# EAGLE design Potentiostat (EAGLE 9.6.2)
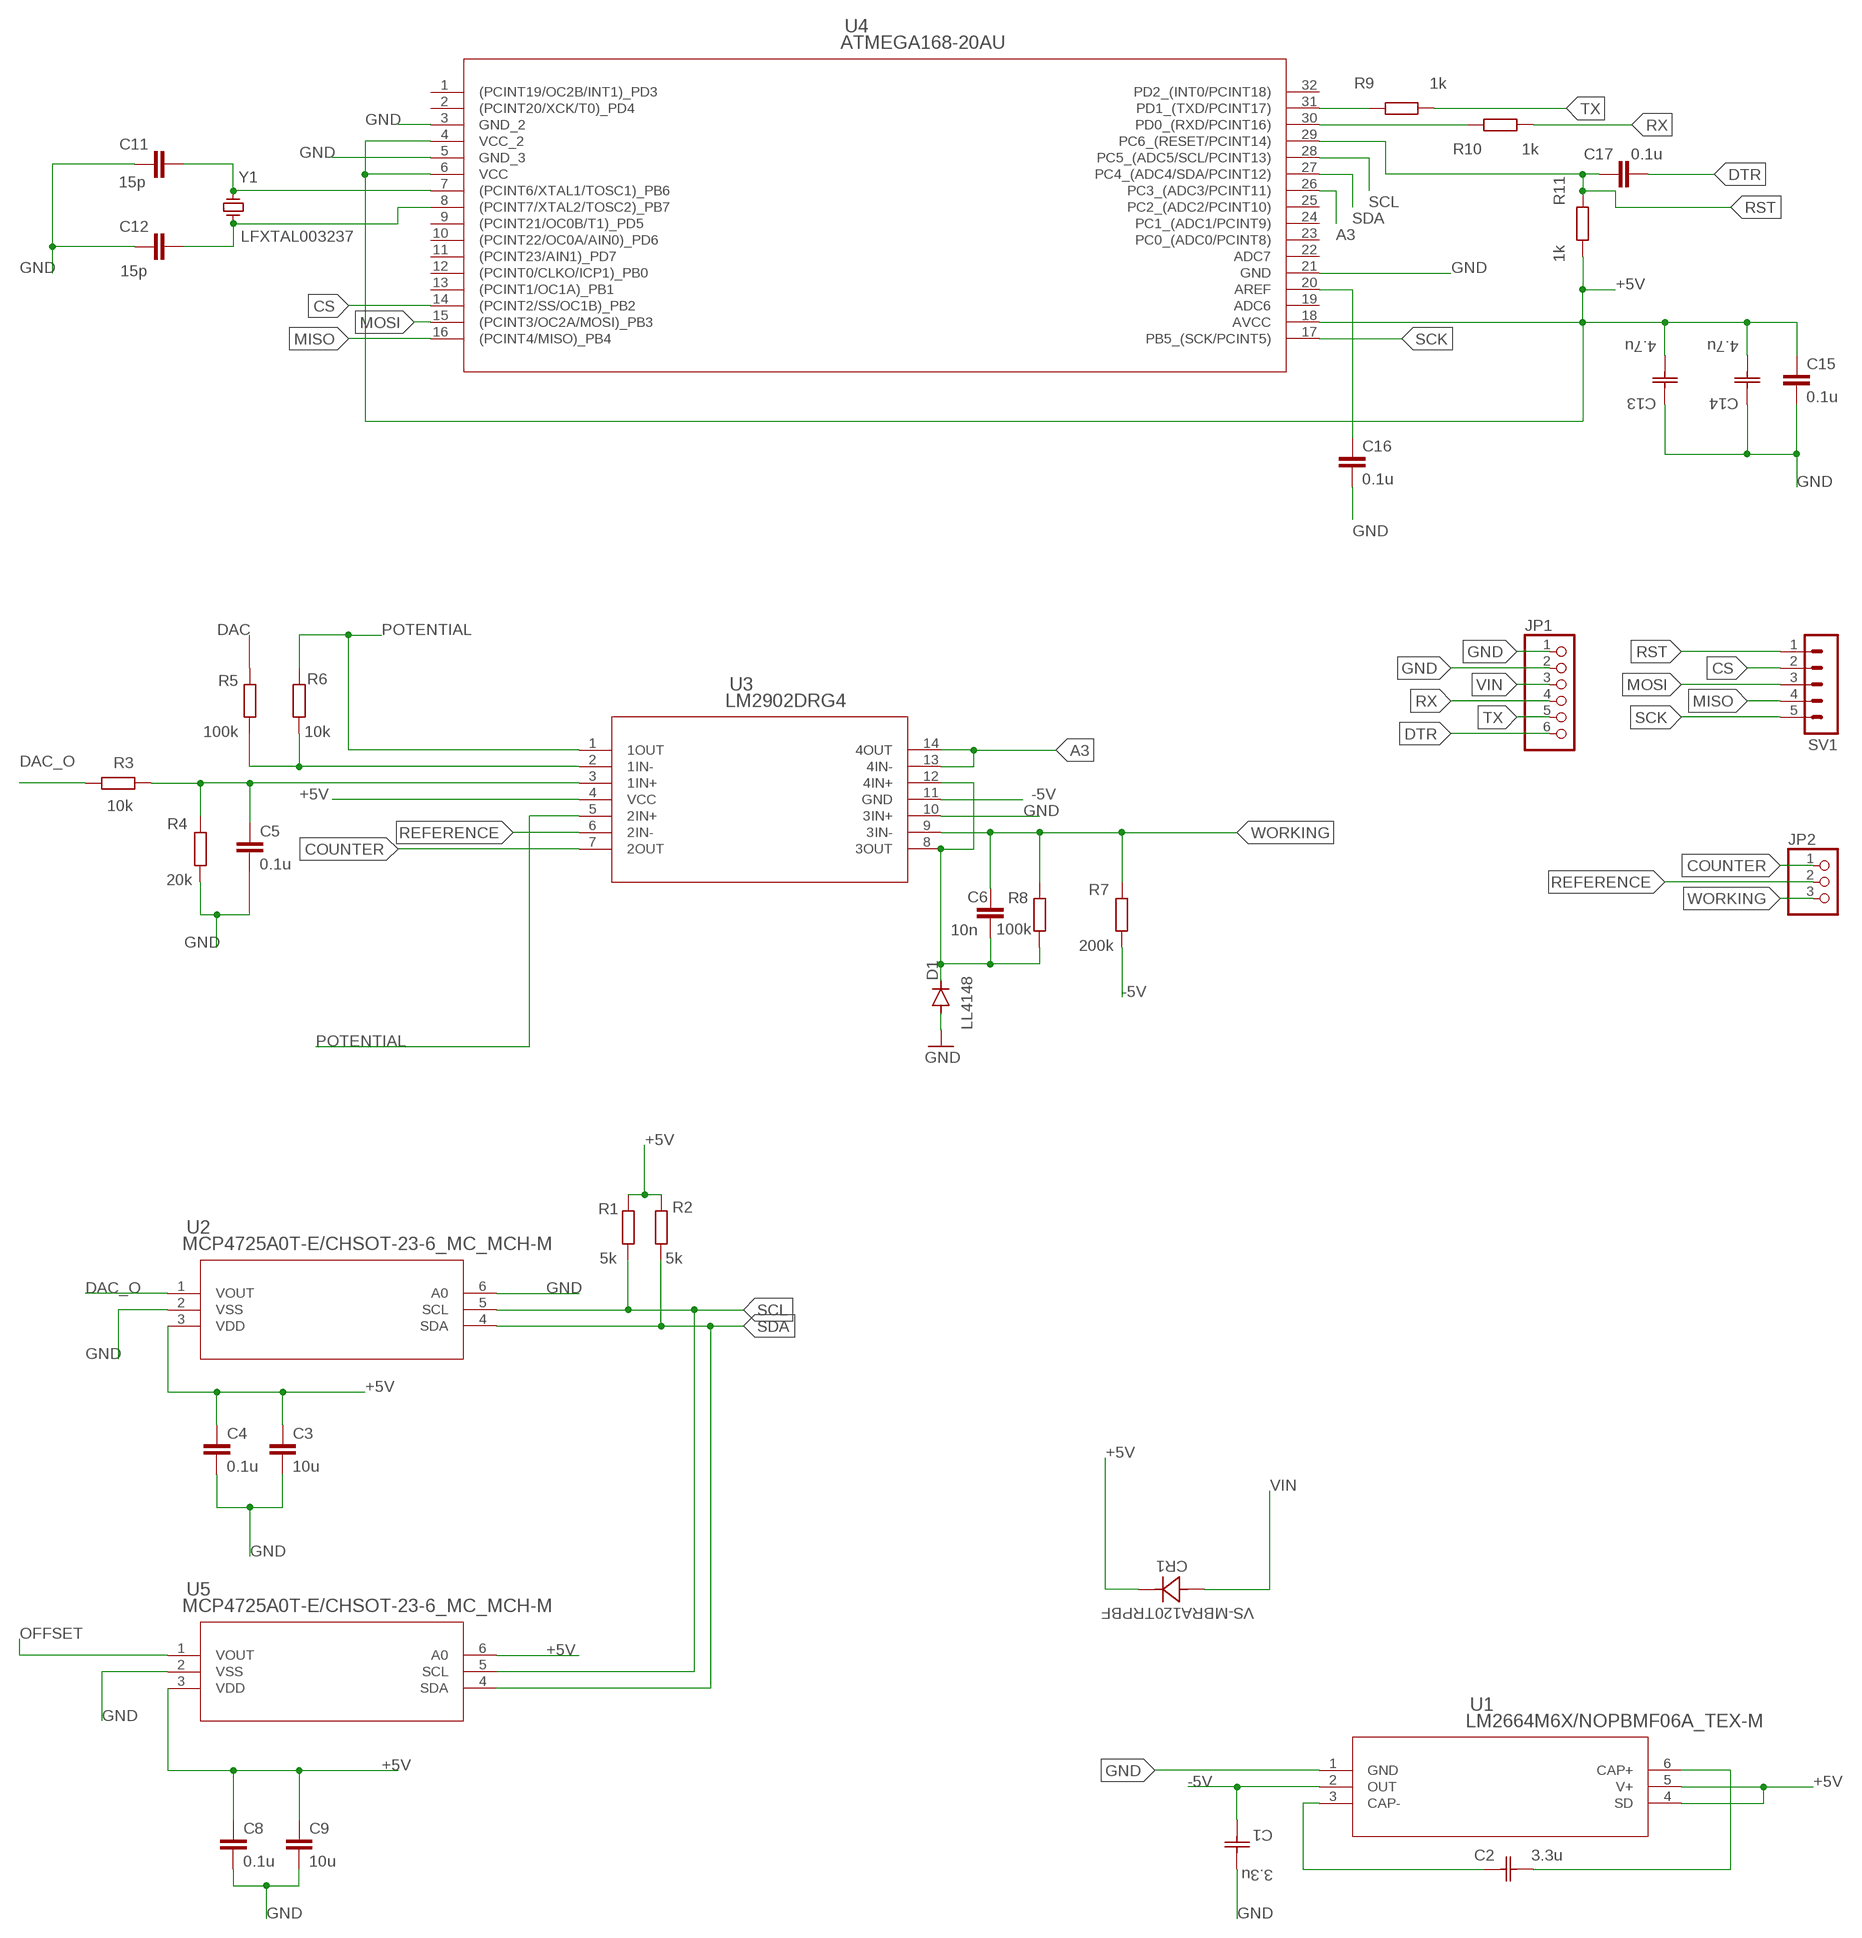
[diagram p0: schematic, sheet 1]

## Parts
C1  3.3u  293D335X9016A2TE3CAP_293D_A_VIS-M  [CAP_293D_A_VIS-M]
C2  3.3u  293D335X9016A2TE3CAP_293D_A_VIS-M  [CAP_293D_A_VIS-M]
C3  10u  C-EUC0805  [C0805]
C4  0.1u  C-EUC0805  [C0805]
C5  0.1u  C-EUC0805  [C0805]
C6  10n  C-EUC0805  [C0805]
C8  0.1u  C-EUC0805  [C0805]
C9  10u  C-EUC0805  [C0805]
C11  15p  C-EUC0805  [C0805]
C12  15p  C-EUC0805  [C0805]
C13  4.7u  293D335X9016A2TE3CAP_293D_A_VIS-M  [CAP_293D_A_VIS-M]
C14  4.7u  293D335X9016A2TE3CAP_293D_A_VIS-M  [CAP_293D_A_VIS-M]
C15  0.1u  C-EUC0805  [C0805]
C16  0.1u  C-EUC0805  [C0805]
C17  0.1u  C-EUC0805  [C0805]
CR1  VS-MBRA120TRPBF  [DIODE_SMA_VIS]
D1  LL4148  DIODE-SOD80C  [SOD80C]
JP1  PINHD-1X6CB  [1X06-CLEANBIG]
JP2  PINHD-1X3CB  [1X03-CLEANBIG]
R1  5k  R-EU_R0805  [R0805]
R2  5k  R-EU_R0805  [R0805]
R3  10k  R-EU_R0805  [R0805]
R4  20k  R-EU_R0805  [R0805]
R5  100k  R-EU_R0805  [R0805]
R6  10k  R-EU_R0805  [R0805]
R7  200k  R-EU_R0805  [R0805]
R8  100k  R-EU_R0805  [R0805]
R9  1k  R-EU_R0805  [R0805]
R10  1k  R-EU_R0805  [R0805]
R11  1k  R-EU_R0805  [R0805]
SV1  MA05-1  [MA05-1]
U1  LM2664M6X/NOPBMF06A_TEX-M  [MF06A_TEX-M]
U2  MCP4725A0T-E/CHSOT-23-6_MC_MCH-M  [SOT-23-6_MC_MCH-M]
U3  LM2902DRG4  [D14_TEX]
U4  ATMEGA168-20AU  [32A_ATM]
U5  MCP4725A0T-E/CHSOT-23-6_MC_MCH-M  [SOT-23-6_MC_MCH-M]
Y1  LFXTAL003237  [XTAL1140X490X430N]

## Nets
+5V: C3.1 C4.1 C8.1 C9.1 C13.2 C14.2 C15.1 CR1.1 R1.2 R2.2 R11.1 U1.4(SD) U1.5(V+) U2.3(VDD) U3.4(VCC) U4.4(VCC_2) U4.6(VCC) U4.18(AVCC) U5.3(VDD) U5.6(A0)
-5V: C1.2 R7.1 U1.2(OUT) U3.11(GND)
A3: U3.13(4IN-) U3.14(4OUT) U4.26(PC3_(ADC3/PCINT11))
COUNTER: JP2.1 U3.7(2OUT)
CS: SV1.2 U4.14((PCINT2/SS/OC1B)_PB2)
DAC: R5.2
DAC_O: R3.2 U2.1(VOUT)
DTR: C17.2 JP1.6
GND: C1.1 C3.2 C4.2 C5.2 C8.2 C9.2 C11.1 C12.1 C13.1 C14.1 C15.2 C16.2 D1.A JP1.1 JP1.2 R4.1 U1.1(GND) U2.2(VSS) U2.6(A0) U3.10(3IN+) U4.3(GND_2) U4.5(GND_3) U4.21(GND) U5.2(VSS)
MISO: SV1.4 U4.16((PCINT4/MISO)_PB4)
MOSI: SV1.3 U4.15((PCINT3/OC2A/MOSI)_PB3)
N$1: C6.2 D1.C R8.1 U3.8(3OUT) U3.12(4IN+)
N$2: C2.1 U1.3(CAP-)
N$3: C5.1 R3.1 R4.2 U3.3(1IN+)
N$4: R5.1 R6.1 U3.2(1IN-)
N$5: C11.2 U4.7((PCINT6/XTAL1/TOSC1)_PB6) Y1.2
N$6: C2.2 U1.6(CAP+)
N$7: C12.2 U4.8((PCINT7/XTAL2/TOSC2)_PB7) Y1.1
N$9: R9.2 U4.31(PD1_(TXD/PCINT17))
N$10: R10.2 U4.30(PD0_(RXD/PCINT16))
N$12: C16.1 U4.20(AREF)
OFFSET: U5.1(VOUT)
POTENTIAL: R6.2 U3.1(1OUT) U3.5(2IN+)
REFERENCE: JP2.2 U3.6(2IN-)
RST: C17.1 R11.2 SV1.1 U4.29(PC6_(RESET/PCINT14))
RX: JP1.4 R10.1
SCK: SV1.5 U4.17(PB5_(SCK/PCINT5))
SCL: R1.1 U2.5(SCL) U4.28(PC5_(ADC5/SCL/PCINT13)) U5.5(SCL)
SDA: R2.1 U2.4(SDA) U4.27(PC4_(ADC4/SDA/PCINT12)) U5.4(SDA)
TX: JP1.5 R9.1
VIN: CR1.2 JP1.3
WORKING: C6.1 JP2.3 R7.2 R8.2 U3.9(3IN-)
Unconnected: U4.1((PCINT19/OC2B/INT1)_PD3) U4.2((PCINT20/XCK/T0)_PD4) U4.9((PCINT21/OC0B/T1)_PD5) U4.10((PCINT22/OC0A/AIN0)_PD6) U4.11((PCINT23/AIN1)_PD7) U4.12((PCINT0/CLKO/ICP1)_PB0) U4.13((PCINT1/OC1A)_PB1) U4.19(ADC6) U4.22(ADC7) U4.23(PC0_(ADC0/PCINT8)) U4.24(PC1_(ADC1/PCINT9)) U4.25(PC2_(ADC2/PCINT10)) U4.32(PD2_(INT0/PCINT18))

## Library data of the parts
C1 C2 C13 C14 = Tantal_capacitor_293D:293D335X9016A2TE3; BUILT_BY: EMA_UL_Team; MANUFACTURER_PART_NUMBER: 293D335X9016A2TE3; SOURCELIBRARY: Vishay_2020-02-10; VENDOR: Vishay
C3-C6 C8 C9 C11 C12 C15-C17 = rcl:C-EU: CAPACITOR, European symbol; SPICEPREFIX: C
CR1 = Schottky Diode SS12L R3G:VS-MBRA120TRPBF; BUILT_BY: EMA_UL_Team; MANUFACTURER_PART_NUMBER: VS-MBRA120TRPBF; SOURCELIBRARY: Vishay_2014-06-20; VENDOR: Vishay
D1 = diode:DIODE-: DIODE
JP1 = adafruit:PINHD-1X6: PIN HEADER
JP2 = adafruit:PINHD-1X3: PIN HEADER
R1-R11 = rcl:R-EU_: RESISTOR, European symbol; SPICEPREFIX: R
SV1 = con-lstb:MA05-1: PIN HEADER; OC_FARNELL: unknown; OC_NEWARK: unknown
U1 = Lm2664m6:LM2664M6X/NOPB; BUILT_BY: EMA_UL_Team; MANUFACTURER_PART_NUMBER: LM2664M6X/NOPB; SOURCELIBRARY: National_2014-06-20; VENDOR: Texas Instruments
U2 U5 = MCP4725A0T:MCP4725A0T-E/CH; BUILT_BY: EMA_UL_Team; MANUFACTURER_PART_NUMBER: MCP4725A0T-E/CH; SOURCELIBRARY: Microchip_2011-05-13; VENDOR: Microchip
U3 = LM2902DRG4:LM2902DRG4; BUILT_BY: EMA_UL_Team; MANUFACTURER: Texas Instruments; MANUFACTURER_PART_NUMBER: LM2902DRG4; SOURCELIBRARY: TI_2014-06-19; VENDOR: Texas Instruments
U4 = ATMEGA168-20AU:ATMEGA168-20AU; COPYRIGHT: Copyright (C) 2015 Accelerated Designs. All rights reserved; MANUFACTURER_PART_NUMBER: ATMEGA168-20AU; SOURCELIBRARY: Atmel_2014-06-19; VENDOR: Atmel
Y1 = LFXTAL003237:LFXTAL003237: HC49/4HSMX Series 16.000 MHz ±30 ppm 16 pF Low Profile Surface Mount Crystal; AVAILABILITY: Unavailable; DESCRIPTION: 16MHz ±30ppm Crystal 16pF 40 Ohms HC-49/US; MF: IQD Frequency Products; MP: LFXTAL003237; PACKAGE: HC-49/US IQD Frequency Products; PRICE: None

## Net classes
0 default: width 0.203 mm, drill 0.203 mm, clearance 0.203 mm

## Board
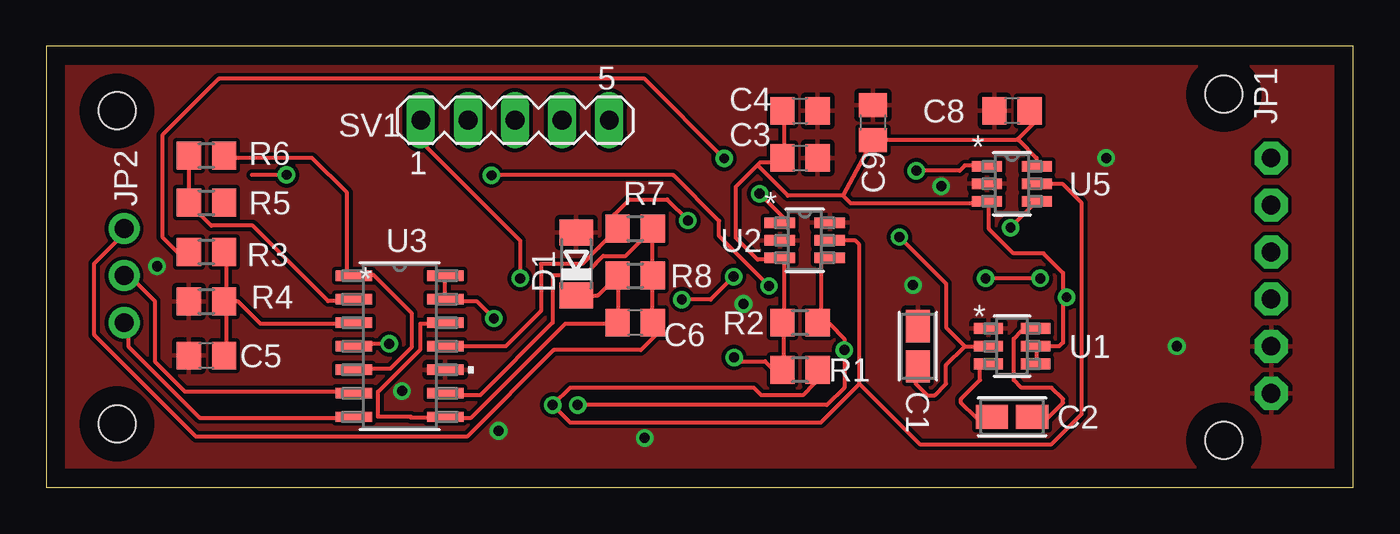
[diagram p1: board, top side]
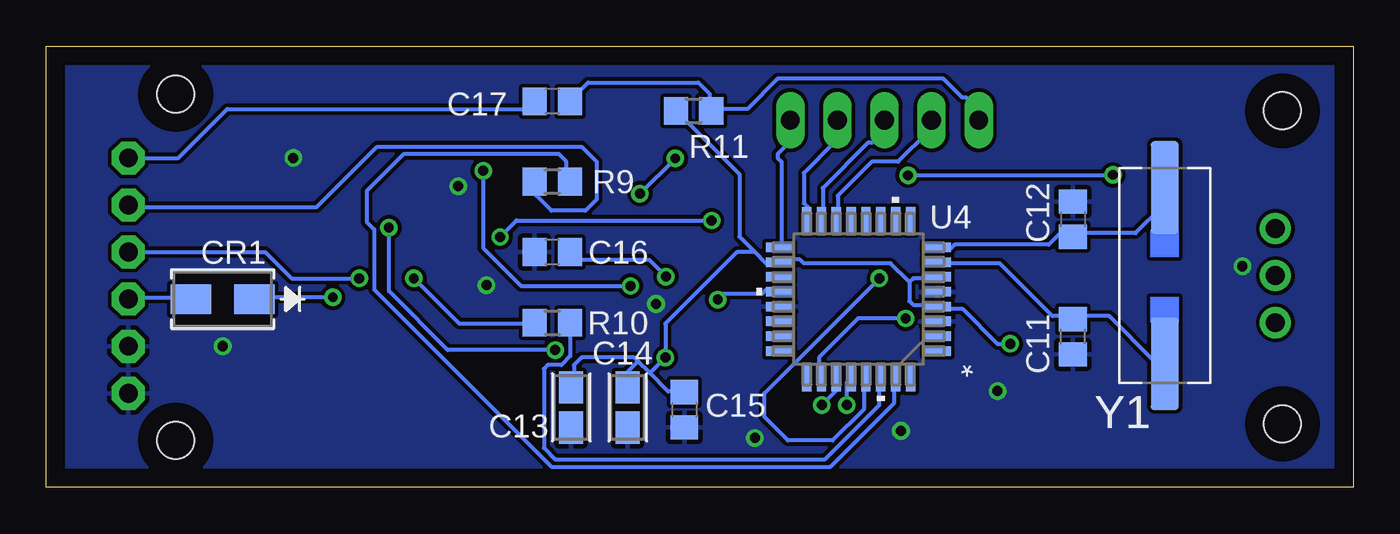
[diagram p2: board, bottom side, seen from below]

Size 70.46 x 23.8 mm. Coordinates in mm from the lower left corner, seen from the top.
Outline: 0,0 70.46,0 70.46,23.8 0,23.8 0,0
Copper layers (1*16): Top 0.035mm / dielectric 1.5mm / Bottom 0.035mm
Design rules "default": minimum track width 6mil, minimum drill 0.35mm, track to track 6mil, track to pad 6mil, pad to pad 6mil, via to via 6mil, smd to smd 6mil, copper to edge 40mil, drill to drill 6mil, minimum pad ring 10mil, minimum via ring 8mil, stop-mask expansion 4mil, vias tented up to drill 0mil, thermal gap 10mil
Holes 2 mm at 3.81,20.32 3.81,3.43 63.5,21.21 63.5,2.54

### Footprints (pad centres in the part's own frame; a part is rotated, then mirrored left to right if it is on the bottom)
CAP_293D_A_VIS-M = smd 1.738 x 1.295: 1 -1.087,0; 2 1.087,0
C0805 = smd 1.3 x 1.5: 1 -0.95,0; 2 0.95,0
DIODE_SMA_VIS = smd 2.184 x 1.575: 1 -1.702,0; 2 1.702,0
SOD80C = smd 1.4 x 1.8: A 1.7,0; C -1.7,0
1X06-CLEANBIG = drill 1.016 pad 1.778 octagon: 1 -6.35,0; 2 -3.81,0; 3 -1.27,0; 4 1.27,0; 5 3.81,0; 6 6.35,0
1X03-CLEANBIG = drill 1.016 pad 1.676: 1 -2.54,0; 2 0,0; 3 2.54,0
R0805 = smd 1.3 x 1.5: 1 -0.95,0; 2 0.95,0
MA05-1 = drill 1.016 long: 1 -5.08,0; 2 -2.54,0; 3 0,0; 4 2.54,0; 5 5.08,0
MF06A_TEX-M = smd 1.575 x 0.584: 1 -1.27,0.953; 2 -1.27,0; 3 -1.27,-0.953; 4 1.27,-0.953; 5 1.27,0; 6 1.27,0.953
SOT-23-6_MC_MCH-M = smd 1.626 x 0.559: 1 -1.346,0.95; 2 -1.346,0; 3 -1.346,-0.95; 4 1.346,-0.95; 5 1.346,0; 6 1.346,0.95
D14_TEX = smd 1.981 x 0.559: 1 -2.464,3.81; 2 -2.464,2.54; 3 -2.464,1.27; 4 -2.464,0; 5 -2.464,-1.27; 6 -2.464,-2.54; 7 -2.464,-3.81; 8 2.464,-3.81; 9 2.464,-2.54; 10 2.464,-1.27; 11 2.464,0; 12 2.464,1.27; 13 2.464,2.54; 14 2.464,3.81
32A_ATM = smd 1.473 x 0.508: 1 -4.242,2.8; 2 -4.242,2; 3 -4.242,1.2; 4 -4.242,0.4; 5 -4.242,-0.4; 6 -4.242,-1.2; 7 -4.242,-2; 8 -4.242,-2.8; 17 4.242,-2.8; 18 4.242,-2; 19 4.242,-1.2; 20 4.242,-0.4; 21 4.242,0.4; 22 4.242,1.2; 23 4.242,2; 24 4.242,2.8 | smd 0.508 x 1.473: 9 -2.8,-4.242; 10 -2,-4.242; 11 -1.2,-4.242; 12 -0.4,-4.242; 13 0.4,-4.242; 14 1.2,-4.242; 15 2,-4.242; 16 2.8,-4.242; 25 2.8,4.242; 26 2,4.242; 27 1.2,4.242; 28 0.4,4.242; 29 -0.4,4.242; 30 -1.2,4.242; 31 -2,4.242; 32 -2.8,4.242
XTAL1140X490X430N = smd 5.01 x 1.51: 1 -4.75,0; 2 4.75,0

### Placement (x,y rotation side)
C1  46.99,7.62 270 top
C2  52.07,3.81 0 top
C3  40.64,17.78 0 top
C4  40.64,20.32 0 top
C5  8.64,7.11 180 top
C6  31.75,8.89 180 top
C8  52.07,20.32 180 top
C9  44.58,19.69 90 top
C11  15.11,8.13 90 bottom
C12  15.11,14.48 270 bottom
C13  42.16,4.32 90 bottom
C14  39.12,4.32 90 bottom
C15  36.07,4.19 270 bottom
C16  43.18,12.7 180 bottom
C17  43.18,20.83 180 bottom
CR1  60.96,10.16 180 bottom
D1  28.57,12.06 90 top
JP1  66.04,11.43 90 top
JP2  4.19,11.43 90 top
R1  40.64,6.35 180 top
R2  40.64,8.89 180 top
R3  8.64,12.7 180 top
R4  8.64,10.03 0 top
R5  8.64,15.37 0 top
R6  8.64,17.91 0 top
R7  31.75,13.97 0 top
R8  31.75,11.43 0 top
R9  43.18,16.51 0 bottom
R10  43.18,8.89 0 bottom
R11  35.56,20.32 0 bottom
SV1  25.27,19.81 0 top
U1  52.07,7.62 0 top
U2  40.89,13.33 0 top
U3  19.05,7.62 0 top
U4  26.67,10.16 180 bottom
U5  52.07,16.38 0 top
Y1  10.16,11.43 270 bottom

### Tracks (layer width: path | path; a pad name or v marks a point on that pad's centre or on a via)
+5V  (via drill 0.53)
  Top 0.203: 44.68,18.92 C9.1 | 50.95,15.55 51.16,15.34 | 50.95,15.55 50.75,15.55 U5.3 | 53.59,17.37 U5.6 53.39,17.37 53.39,17.78 52.44,18.73 | 39.57,12.29 U2.3 | 39.57,9.04 R2.2 | 39.78,17.78 39.78,17.55 38.51,17.55 38.34,17.39 | 39.22,6.4 39.57,6.4 R1.2 | 39.78,17.78 39.78,20.22 C4.1 | 39.78,17.78 C3.1 | R1.2 39.78,6.4 39.78,8.84 R2.2 | R2.2 39.78,9.04 39.78,12.29 39.57,12.5 U2.3 | 38.34,17.39 37.19,16.23 37.19,13.46 38.35,12.29 39.37,12.29 U2.3 | 53.39,7.62 53.39,6.81 U1.4 | U5.3 50.55,15.34 43.37,15.34 42.96,15.75 | 45.12,18.73 C9.1 | C8.1 53.19,20.22 53.19,19.61 52.38,18.8 52.44,18.73 | 53.39,7.62 54.61,7.62 54.81,7.82 54.81,10.26 | 54.81,10.26 54.81,11.58 53.77,12.62 52.15,12.62 50.82,13.95 50.82,15.21 50.95,15.34 50.95,15.55 | 53.39,7.62 U1.5 | 50.95,15.55 U5.3 | 54.81,10.26 v55.02,10.26 | 38.34,17.39 39.98,15.75 42.96,15.75 | C9.1 42.96,15.75 | v18.49,7.75 16.71,7.75 U3.4 | v37.08,7.01 37.29,6.81 38.76,6.81 39.17,6.4 R1.2 | 52.44,18.73 C9.1
  Bottom 0.203: 42.01,5.49 C13.2 42.01,5.59 42.01,6.6 41.61,7.01 38.76,7.01 38.56,6.81 | v55.02,10.26 59.08,10.26 CR1.1 | 38.56,6.81 39.17,6.2 39.17,5.59 C14.2 | 37.92,6.17 v37.08,7.01 37.08,8.84 33.22,12.7 32.26,12.7 | C15.1 36.12,5.18 36.93,5.18 37.92,6.17 | 37.92,6.17 38.56,6.81 | 23.93,11.07 23.93,10.06 23.72,9.86 22.5,9.86 U4.4 22.3,9.65 21.08,9.65 19.18,7.75 v18.49,7.75 | 23.93,11.07 23.72,11.28 22.5,11.28 U4.6 | 23.93,11.07 24.94,12.09 29.62,12.09 29.82,12.29 30.84,12.29 U4.18 31.04,12.09 31.65,12.09 32.26,12.7 | R11.1 33.1,16.91 33.1,13.54 32.26,12.7
-5V  (via drill 0.53)
  Top 0.203: 47.09,6.4 C1.2 46.89,6.4 46.89,5.59 47.5,4.98 47.9,4.98 48.51,5.59 48.51,6.6 49.53,7.62 | 49.53,7.62 U1.2 | 30.74,13.95 R7.1 | 49.53,7.62 48.51,8.64 48.51,11 v46,13.51 | v34.59,14.4 34.59,14.43 33.48,15.55 31.44,15.55 30.63,14.73 30.63,14.12 R7.1 | R7.1 29.78,12.95 29.78,12.94 28.91,12.06 26.67,12.06 26.67,9.52 24.76,7.62 U3.11
  Bottom 0.203: v46,13.51 45.11,14.4 v34.59,14.4
A3  (via drill 0.53)
  Top 0.203: v24.13,9.12 23.19,10.06 21.69,10.06 U3.13 21.49,10.26 21.49,11.28 U3.14
  Bottom 0.203: v24.13,9.12 26.69,9.12 28.8,7.01 28.8,5.99 U4.26
COUNTER
  Top 0.203: U3.7 16.41,3.76 8.28,3.76 4.42,7.62 4.42,8.64 4.22,8.84 JP2.1
  Bottom 0.203: 4.24,8.84 JP2.1
CS
  Bottom 0.203: U4.14 27.79,14.53 27.79,15.75 25.96,17.58 24.54,17.58 22.91,19.2 22.91,19.81 SV1.2
DAC_O  (via drill 0.53)
  Top 0.203: R3.2 7.06,12.7 6.25,13.51 6.25,19 9.3,22.05 32.26,22.05 v36.55,17.75 | v38.46,15.85 39.78,14.53 39.78,14.33 39.57,14.12 U2.1
  Bottom 0.203: v38.46,15.85 v36.55,17.75
DTR
  Bottom 0.203: 44.2,20.78 C17.2 44.6,20.42 60.71,20.42 63.35,17.78 JP1.6
GND  (via drill 0.53, 0.55)
  other vias: 32.26,2.67 48.26,16.26 57.15,17.78 46.74,10.92 19.18,5.21 24.38,3.05 5.97,11.94 37.59,9.91 60.96,7.62
  pour Top: -1.27,25.4 -1.27,-1.27 69.85,-1.27 69.85,25.4
  pour Bottom: -2.54,26.67 -2.54,-2.54 71.12,-2.54 71.12,26.67
MISO
  Bottom 0.203: U4.16 29.41,14.53 29.41,15.14 29.62,15.34 29.62,16.97 27.99,18.59 27.99,19.81 SV1.4
MOSI
  Bottom 0.203: U4.15 28.6,14.53 28.6,16.15 26.16,18.59 25.96,18.59 25.35,19.2 25.35,19.81 SV1.3
N$1
  Top 0.203: 21.69,8.84 U3.12 21.49,8.84 20.17,8.84 20.17,7.45 17.88,5.17 17.88,3.81 19.66,3.81 19.66,3.76 21.49,3.76 U3.8 21.69,3.76 22.91,3.76 27.99,8.84 30.63,8.84 C6.2 30.84,9.04 30.84,11.28 R8.1 29.73,10.36 D1.C
N$2
  Top 0.203: 50.34,6.6 50.55,6.81 50.75,6.81 U1.3 50.34,6.6 | 50.95,3.96 C2.1 50.95,3.76 50.14,3.76 49.33,4.57 49.33,4.77 50.34,5.79 50.34,6.6
N$3
  Top 0.203: C5.1 9.7,7.21 9.7,9.86 R4.2 9.7,10.06 | 9.7,10.06 9.7,12.7 R3.1 | 9.7,10.06 10.31,10.06 11.53,8.84 16.41,8.84 U3.3
N$4
  Top 0.203: 16.41,10.26 U3.2 16.41,10.06 15.19,10.06 11.12,14.12 8.89,14.12 7.87,15.14 7.87,15.34 R5.1 | 7.67,15.34 R5.1 | R5.1 7.67,15.55 7.67,17.78 R6.1
N$5
  Bottom 0.203: U4.7 22.3,12.09 19.05,12.09 16.21,9.25 15.19,9.25 C11.2 14.99,9.25 13.16,9.25 10.72,6.81 10.31,6.81 Y1.2
N$6
  Top 0.203: 53.19,3.96 C2.2 53.19,3.76 54,3.76 54.81,4.57 54.81,4.77 54.2,5.38 52.58,5.38 52.17,5.79 52.17,8.03 52.58,8.43 53.19,8.43 U1.6
N$7
  Bottom 0.203: U4.8 22.3,12.9 21.69,12.9 21.49,13.11 16.41,13.11 15.8,13.72 15.19,13.72 C12.2 14.99,13.72 11.73,13.72 10.31,15.14 10.31,16.15 Y1.1
N$9
  Bottom 0.203: U4.31 24.74,5.79 24.74,4.57 28.19,1.12 43.23,1.12 52.78,10.67 52.78,13.92 53.19,14.33 53.19,16 51.21,17.98 42.82,17.98 42.42,17.58 42.42,16.56 R9.2
N$10
  Bottom 0.203: 42.37,8.74 R10.2 42.22,8.84 42.22,7.09 42.7,6.6 43.43,6.6 43.64,6.4 43.64,2.13 43.03,1.52 28.47,1.52 25.55,4.45 25.55,5.79 U4.30
N$12  (via drill 0.53)
  Top 0.203: v34.27,10.13 35.81,10.13 v37.06,11.38
  Bottom 0.203: v34.27,10.13 33.93,10.46 31.85,10.46 31.65,10.67 31.04,10.67 U4.20 | v37.06,11.38 37.97,12.29 41.81,12.29 42.22,12.7 C16.1
OFFSET  (via drill 0.53)
  Top 0.203: v12.95,16.87 11.08,16.87 | v24,16.84 33.81,16.84 36.27,14.38 36.27,13.56 v38.96,10.87 | v46.91,17.09 49.25,17.09 49.53,17.37 50.55,17.37 U5.1
  Bottom 0.203: v24,16.84 12.98,16.84 v12.95,16.87 | v38.96,10.87 44.86,10.87 46.91,12.93 v46.91,17.09
POTENTIAL
  Top 0.203: 9.7,17.98 R6.2 9.7,17.78 14.33,17.78 16.21,15.9 16.21,11.48 16.26,11.43 U3.1 | 16.41,11.48 U3.1 | U3.5 16.61,6.4 18.54,6.4 19.68,7.54 19.68,9.42 17.63,11.48 16.61,11.48 16.59,11.45 U3.1
REFERENCE
  Top 0.203: U3.6 16.41,5.18 7.47,5.18 5.84,6.81 5.84,10.06 4.62,11.28 4.22,11.28 JP2.2
RST  (via drill 0.53)
  Top 0.203: v25.55,11.28 25.55,13.31 20.27,18.59 20.27,19.81 SV1.1
  Bottom 0.203: C17.1 42.23,20.86 41.25,21.84 35.31,21.84 34.7,21.23 34.7,20.42 R11.2 34.49,20.42 32.66,20.42 31.04,22.05 22.1,22.05 21.08,21.03 20.88,21.03 20.27,20.42 20.27,19.81 SV1.1 | v25.55,11.28 31.75,5.08 31.75,3.81 30.48,2.54 28.07,2.54 26.36,4.24 26.36,5.79 U4.29
RX  (via drill 0.53)
  Top 0.203: v53.59,11.28 v50.65,11.28
  Bottom 0.203: 44.2,8.94 R10.1 44.25,8.84 48.21,8.84 v50.65,11.28 | v53.59,11.28 57.25,11.28 58.67,12.7 JP1.4
SCK
  Bottom 0.203: U4.17 30.84,13.11 30.84,17.58 31.04,17.78 31.04,17.98 30.43,18.59 30.43,19.81 SV1.5
SCL  (via drill 0.53)
  Top 0.203: 41.59,6.41 R1.1 41.4,6.2 41.4,5.59 40.79,4.98 38.56,4.98 38.15,5.38 28.25,5.38 v27.3,4.45 28.25,3.5 41.76,3.5 43.84,5.59 | 43.84,5.59 43.84,13.11 43.64,13.31 42.42,13.31 U2.5 | 43.84,5.59 47.09,2.34 54.2,2.34 55.83,3.96 55.83,15.34 54.81,16.36 53.59,16.36 U5.5
  Bottom 0.203: v27.3,4.45 27.3,5.64 U4.28
SDA  (via drill 0.53)
  Top 0.203: 41.81,12.29 42.01,12.5 42.22,12.5 U2.4 41.81,12.29 | 41.61,9.04 R2.1 | v28.65,4.45 42.09,4.45 43.03,5.38 v43.03,7.42 43.03,8.03 42.22,8.84 41.81,8.84 | 41.81,8.84 41.61,8.84 R2.1 | 41.81,8.84 41.81,12.29 | 41.81,8.84 R2.1 | v51.99,14.02 53.31,15.34 53.39,15.34 U5.4
  Bottom 0.203: v28.65,4.45 27.79,5.31 27.79,5.79 U4.27 | v51.99,14.02 51.99,10.59 48.82,7.42 v43.03,7.42
TX
  Bottom 0.203: 65.99,15.34 JP1.5 65.99,15.14 55.88,15.14 52.63,18.39 41.61,18.39 40.79,17.58 40.79,15.55 41.4,14.94 43.23,14.94 44.04,15.75 44.04,16.36 R9.1
VIN
  Bottom 0.203: CR1.2 62.74,10.26 65.99,10.26 JP1.3
WORKING
  Top 0.203: 32.66,8.84 C6.1 | C6.1 32.66,9.04 32.66,11.28 R8.2 32.66,11.48 32.66,13.51 | 32.66,13.51 32.66,13.92 R7.2 32.66,13.51 | 32.66,13.51 32.26,13.51 31.24,12.5 30.02,12.5 29.62,12.09 29.62,12.06 28.98,11.43 27.3,11.43 27.3,8.89 23.39,4.98 21.69,4.98 U3.9 | JP2.3 4.01,13.92 4.01,13.51 2.59,12.09 2.59,8.23 8.08,2.74 22.68,2.74 27.36,7.42 32.05,7.42 32.87,8.23 32.87,8.84 C6.1
(copper drawn outside any net)
  shapes: Bottom area x2

### Text on the board
bNames: Y1